# EAGLE design openWall_onBoardPCB (EAGLE 6.4)
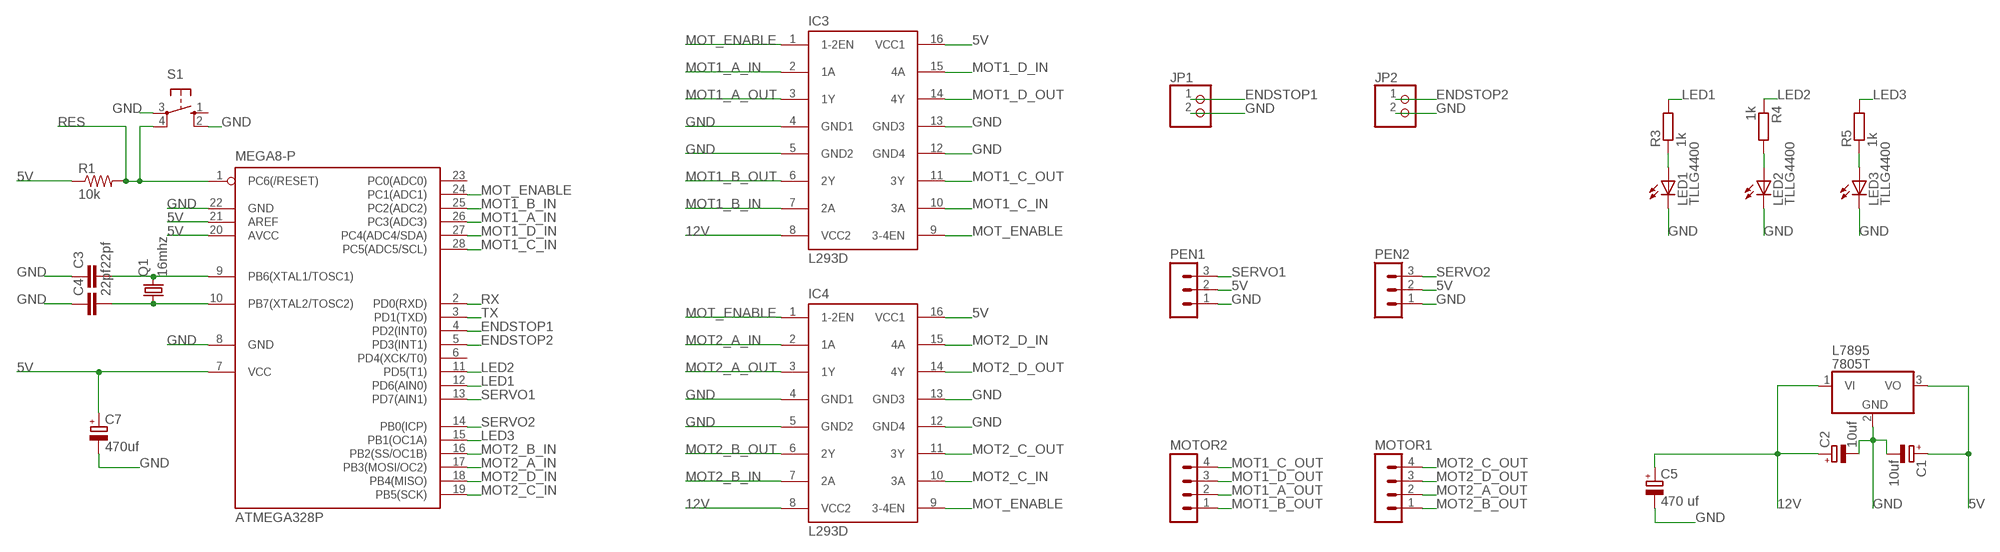
[diagram p0: schematic, sheet 1, part 1 of 2]
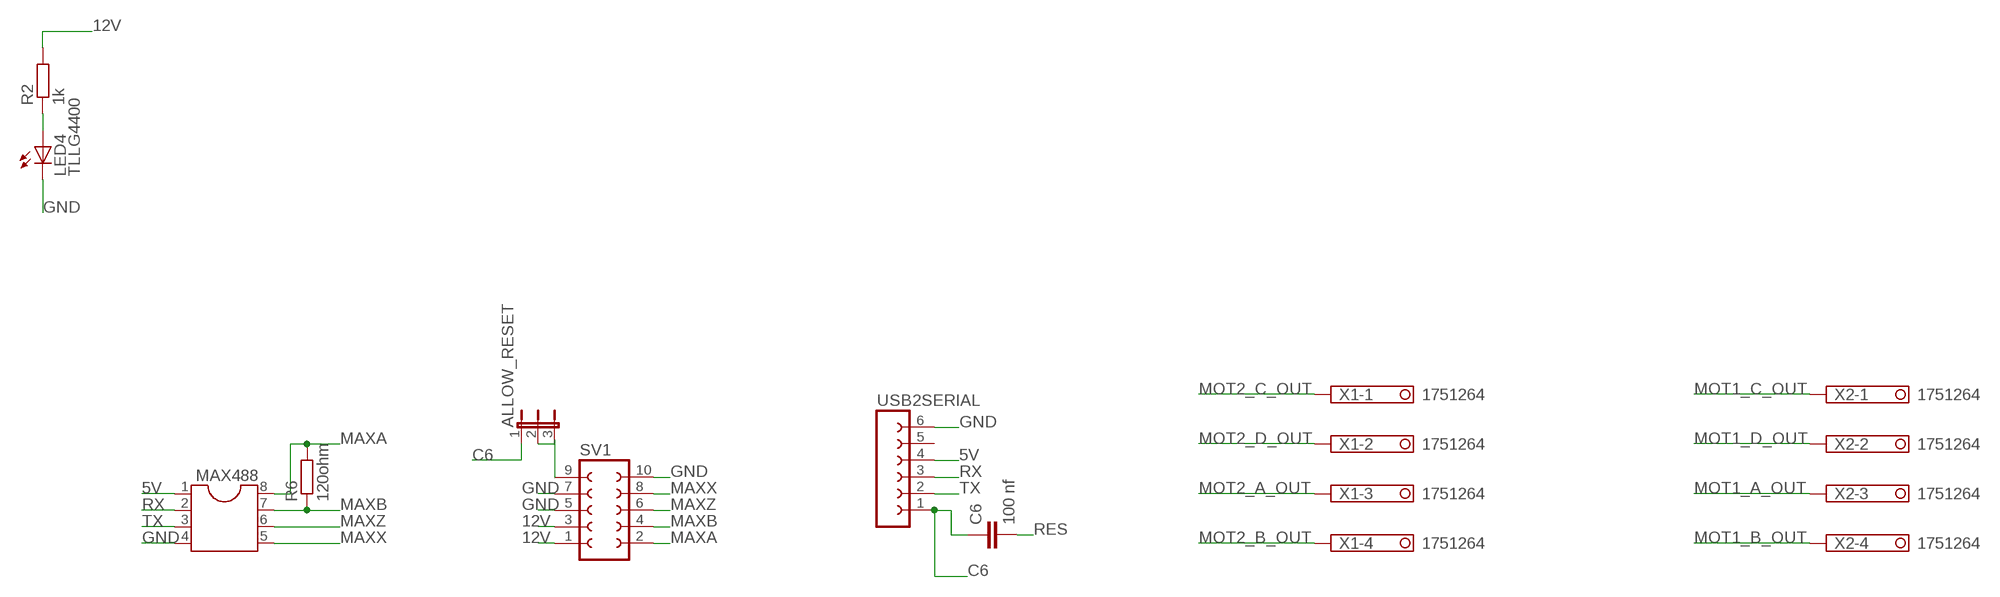
[diagram p1: schematic, sheet 1, part 2 of 2]

## Parts
ALLOW_RESET  JP2E  [JP2]
ATMEGA328P  MEGA8-P  [DIL28-3]
C1  10uf  CPOL-EUE2.5-6  [E2,5-6]
C2  10uf  CPOL-EUE2.5-6  [E2,5-6]
C3  22pf  C-EU025-030X050  [C025-030X050]
C4  22pf  C-EU025-030X050  [C025-030X050]
C5  470 uf  CPOL-EUE5-6  [E5-6]
C6  100 nf  C-EU050-024X044  [C050-024X044]
C7  470uf  CPOL-EUE5-6  [E5-6]
IC3  L293D  [DIL16]
IC4  L293D  [DIL16]
JP1  PINHD-1X2  [1X02]
JP2  PINHD-1X2  [1X02]
L7895  7805T  [TO220H]
LED1  TLLG4400  [LED3MM]
LED2  TLLG4400  [LED3MM]
LED3  TLLG4400  [LED3MM]
LED4  TLLG4400  [LED3MM]
MAX488  DIL8  [DIL08]
MOTOR1  MA04-1  [MA04-1]
MOTOR2  MA04-1  [MA04-1]
PEN1  MA03-1  [MA03-1]
PEN2  MA03-1  [MA03-1]
Q1  16mhz  CRYSTALHC49S  [HC49/S]
R1  10k  R-US_0207/7  [0207/7]
R2  1k  R-EU_0207/7  [0207/7]
R3  1k  R-EU_0309/V  [0309V]
R4  1k  R-EU_0309/V  [0309V]
R5  1k  R-EU_0309/V  [0309V]
R6  120ohm  R-EU_0207/7  [0207/7]
S1  10-XX  [B3F-10XX]
SV1  FE05-2  [FE05-2]
USB2SERIAL  FE06-1  [FE06]
X1  1751264  [1751264]
X2  1751264  [1751264]

## Nets
5V: ATMEGA328P.7(VCC) ATMEGA328P.20(AVCC) ATMEGA328P.21(AREF) C1.+ C7.+ IC3.16(VCC1) IC4.16(VCC1) L7895.3(VO) MAX488.1 PEN1.2 PEN2.2 R1.1 USB2SERIAL.4
12V: C2.+ C5.+ IC3.8(VCC2) IC4.8(VCC2) L7895.1(VI) R2.2 SV1.1 SV1.3
C6: ALLOW_RESET.1 C6.1 USB2SERIAL.1
ENDSTOP1: ATMEGA328P.4(PD2(INT0)) JP1.1
ENDSTOP2: ATMEGA328P.5(PD3(INT1)) JP2.1
GND: ATMEGA328P.8(GND) ATMEGA328P.22(GND) C1.- C2.- C3.1 C4.1 C5.- C7.- IC3.4(GND1) IC3.5(GND2) IC3.12(GND4) IC3.13(GND3) IC4.4(GND1) IC4.5(GND2) IC4.12(GND4) IC4.13(GND3) JP1.2 JP2.2 L7895.2(GND) LED1.K(C) LED2.K(C) LED3.K(C) LED4.K(C) MAX488.4 PEN1.1 PEN2.1 S1.2(S1) S1.3(P) SV1.5 SV1.7 SV1.10 USB2SERIAL.6
LED1: ATMEGA328P.12(PD6(AIN0)) R3.2
LED2: ATMEGA328P.11(PD5(T1)) R4.1
LED3: ATMEGA328P.15(PB1(OC1A)) R5.2
MAXA: MAX488.8 R6.2 SV1.2
MAXB: MAX488.7 R6.1 SV1.4
MAXX: MAX488.5 SV1.8
MAXZ: MAX488.6 SV1.6
MOT1_A_IN: ATMEGA328P.26(PC3(ADC3)) IC3.2(1A)
MOT1_A_OUT: IC3.3(1Y) MOTOR2.2 X2.3
MOT1_B_IN: ATMEGA328P.25(PC2(ADC2)) IC3.7(2A)
MOT1_B_OUT: IC3.6(2Y) MOTOR2.1 X2.4
MOT1_C_IN: ATMEGA328P.28(PC5(ADC5/SCL)) IC3.10(3A)
MOT1_C_OUT: IC3.11(3Y) MOTOR2.4 X2.1
MOT1_D_IN: ATMEGA328P.27(PC4(ADC4/SDA)) IC3.15(4A)
MOT1_D_OUT: IC3.14(4Y) MOTOR2.3 X2.2
MOT2_A_IN: ATMEGA328P.17(PB3(MOSI/OC2)) IC4.2(1A)
MOT2_A_OUT: IC4.3(1Y) MOTOR1.2 X1.3
MOT2_B_IN: ATMEGA328P.16(PB2(SS/OC1B)) IC4.7(2A)
MOT2_B_OUT: IC4.6(2Y) MOTOR1.1 X1.4
MOT2_C_IN: ATMEGA328P.19(PB5(SCK)) IC4.10(3A)
MOT2_C_OUT: IC4.11(3Y) MOTOR1.4 X1.1
MOT2_D_IN: ATMEGA328P.18(PB4(MISO)) IC4.15(4A)
MOT2_D_OUT: IC4.14(4Y) MOTOR1.3 X1.2
MOT_ENABLE: ATMEGA328P.24(PC1(ADC1)) IC3.1(1-2EN) IC3.9(3-4EN) IC4.1(1-2EN) IC4.9(3-4EN)
N$1: ATMEGA328P.10(PB7(XTAL2/TOSC2)) C4.2 Q1.1
N$2: ATMEGA328P.9(PB6(XTAL1/TOSC1)) C3.2 Q1.2
N$3: LED1.A R3.1
N$4: LED4.A R2.1
N$5: LED2.A R4.2
N$6: LED3.A R5.1
N$7: SV1.9
N$10: ALLOW_RESET.2 ALLOW_RESET.3
RES: ATMEGA328P.1(PC6(/RESET)) C6.2 R1.2 S1.4(P1)
RX: ATMEGA328P.2(PD0(RXD)) MAX488.2 USB2SERIAL.3
SERVO1: ATMEGA328P.13(PD7(AIN1)) PEN1.3
SERVO2: ATMEGA328P.14(PB0(ICP)) PEN2.3
TX: ATMEGA328P.3(PD1(TXD)) MAX488.3 USB2SERIAL.2
Unconnected: ATMEGA328P.6(PD4(XCK/T0)) ATMEGA328P.23(PC0(ADC0)) S1.1(S) USB2SERIAL.5

## Library data of the parts
ALLOW_RESET = jumper:JP2E: JUMPER
ATMEGA328P = atmel:MEGA8-P: MICROCONTROLLER 8 Kbytes FLASH, 1 kbytes SRAM, 512 bytes EEPROM, USART, 4-channel 10 bit ADC, 2-channel 8 bit ADC Pin compatible with Atmega48, ATMega88, ATMega168 Source: avr.lbr; OC_FARNELL: unknown; OC_NEWARK: unknown
C1 C2 C5 C7 = rcl:CPOL-EU: POLARIZED CAPACITOR, European symbol
C3 C4 C6 = rcl:C-EU: CAPACITOR, European symbol
IC3 IC4 = st-microelectronics:L293D: PUSH-PULL 4 CHANNEL DRIVER; MPN: L293D; OC_FARNELL: 9589619; OC_NEWARK: 56P8249
JP1 JP2 = pinhead:PINHD-1X2: PIN HEADER
L7895 = adafruit:78*: Positive VOLTAGE REGULATOR Added bigger pads to the TO-92 package
LED1-LED4 = led:TLLG4400: Low Current (2mA) LED 3 mm Tinted Diffused Package color GREEN Source: Data sheet <http://www.farnell.com/datasheets/391098.pdf>; MF: VISHAY SEMICONDUCTOR; OC_FARNELL: 1612435
MAX488 = ic-package:DIL8: Dual In Line / Socket
MOTOR1 MOTOR2 = con-lstb:MA04-1: PIN HEADER; OC_FARNELL: unknown; OC_NEWARK: unknown
PEN1 PEN2 = con-lstb:MA03-1: PIN HEADER; OC_FARNELL: unknown; OC_NEWARK: unknown
Q1 = adafruit:CRYSTAL: CRYSTAL; OC_FARNELL: 1667008; OC_NEWARK: unknown
R1 = adafruit:R-US_: RESISTOR, American symbol
R2 = resistor:R-EU_: RESISTOR, European symbol
R3-R6 = rcl:R-EU_: RESISTOR, European symbol
S1 = switch-omron:10-XX: OMRON SWITCH; MPN: B3F-1000; OC_FARNELL: 176432; OC_NEWARK: 36M3542
SV1 = con-lsta:FE05-2: FEMALE HEADER; OC_FARNELL: unknown; OC_NEWARK: unknown
USB2SERIAL = con-lsta:FE06-1: FEMALE HEADER; OC_FARNELL: unknown; OC_NEWARK: unknown
X1 X2 = con-phoenix-350:1751264: MKDS 1/ 4-3,5 Printklemme Nennstrom: 10 A Bemessungsspannung: 160 V Raster: 3,5 mm Polzahl: 4 Montageart: Löten Anschlussart: Schraubanschluss Anschlussrichtung vom Leiter zur Platine: 0° Source: http://eshop.phoenixcontact.com .. 1751264.pdf; MPN: 1751264; OC_FARNELL: unknown; OC_NEWARK: 10R0934

## Board
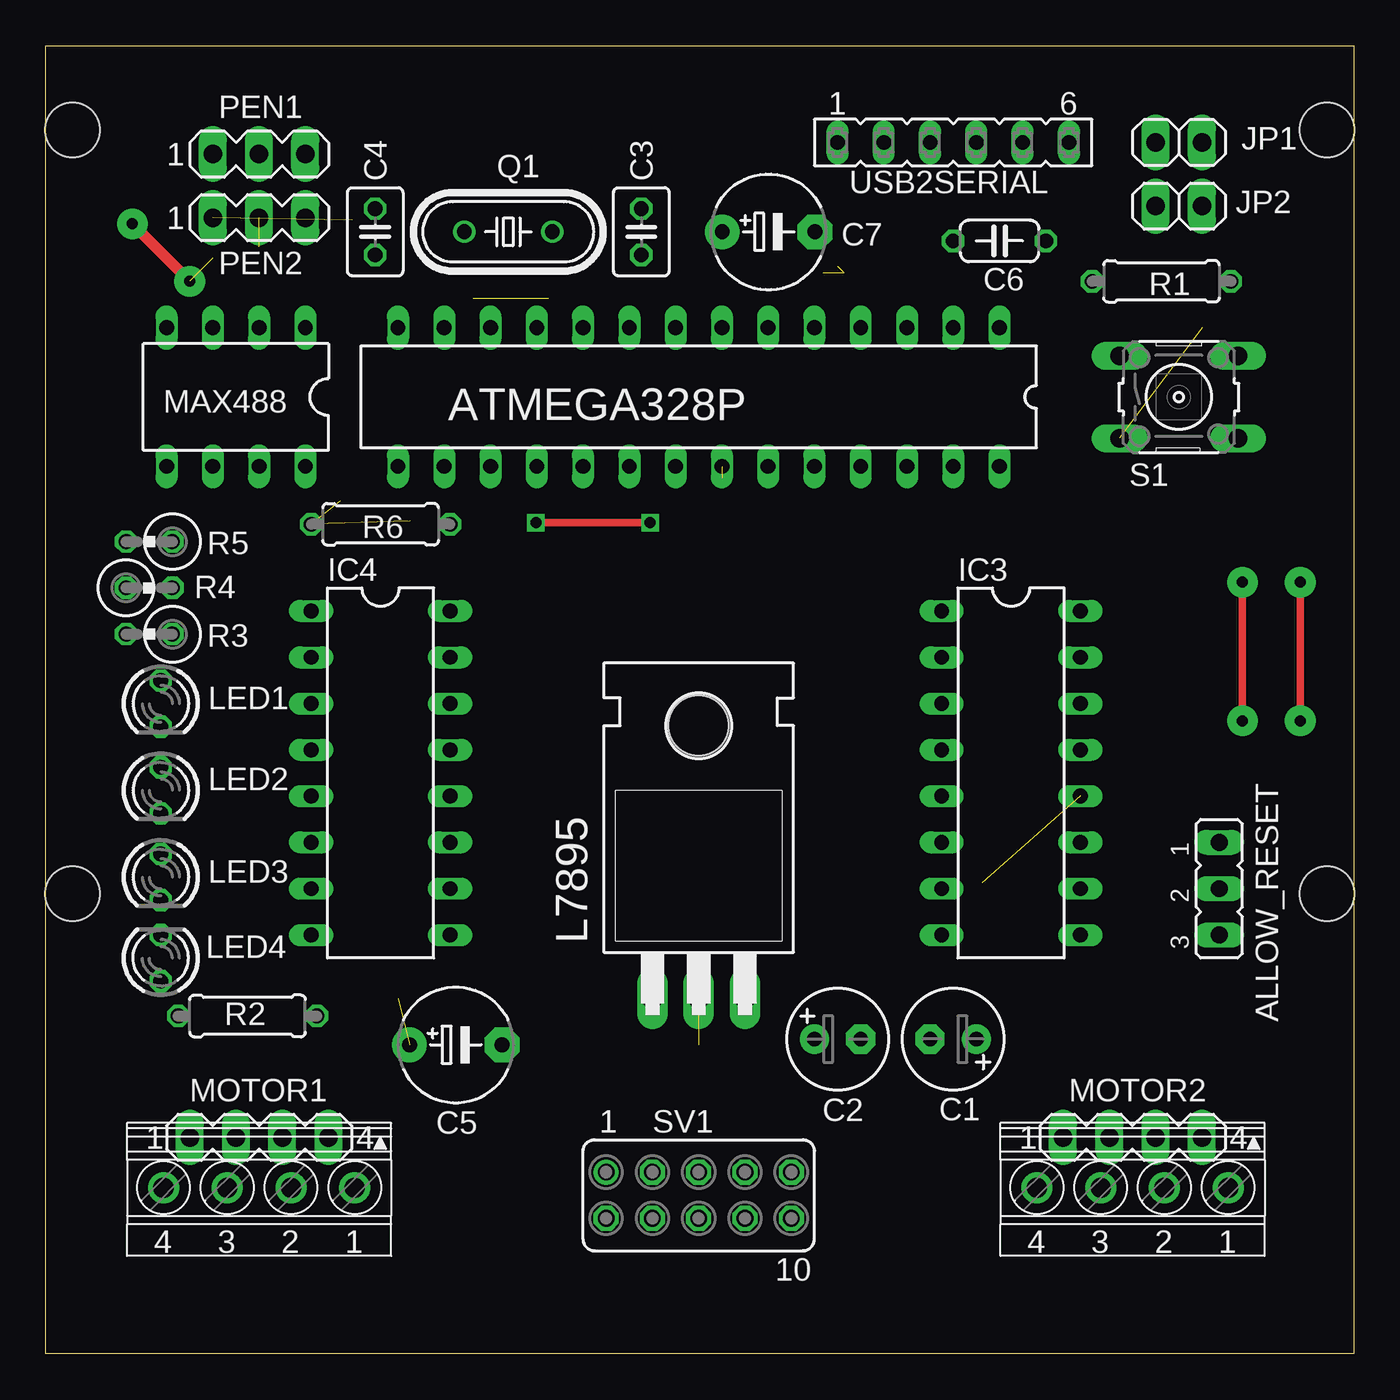
[diagram p2: board, top side]
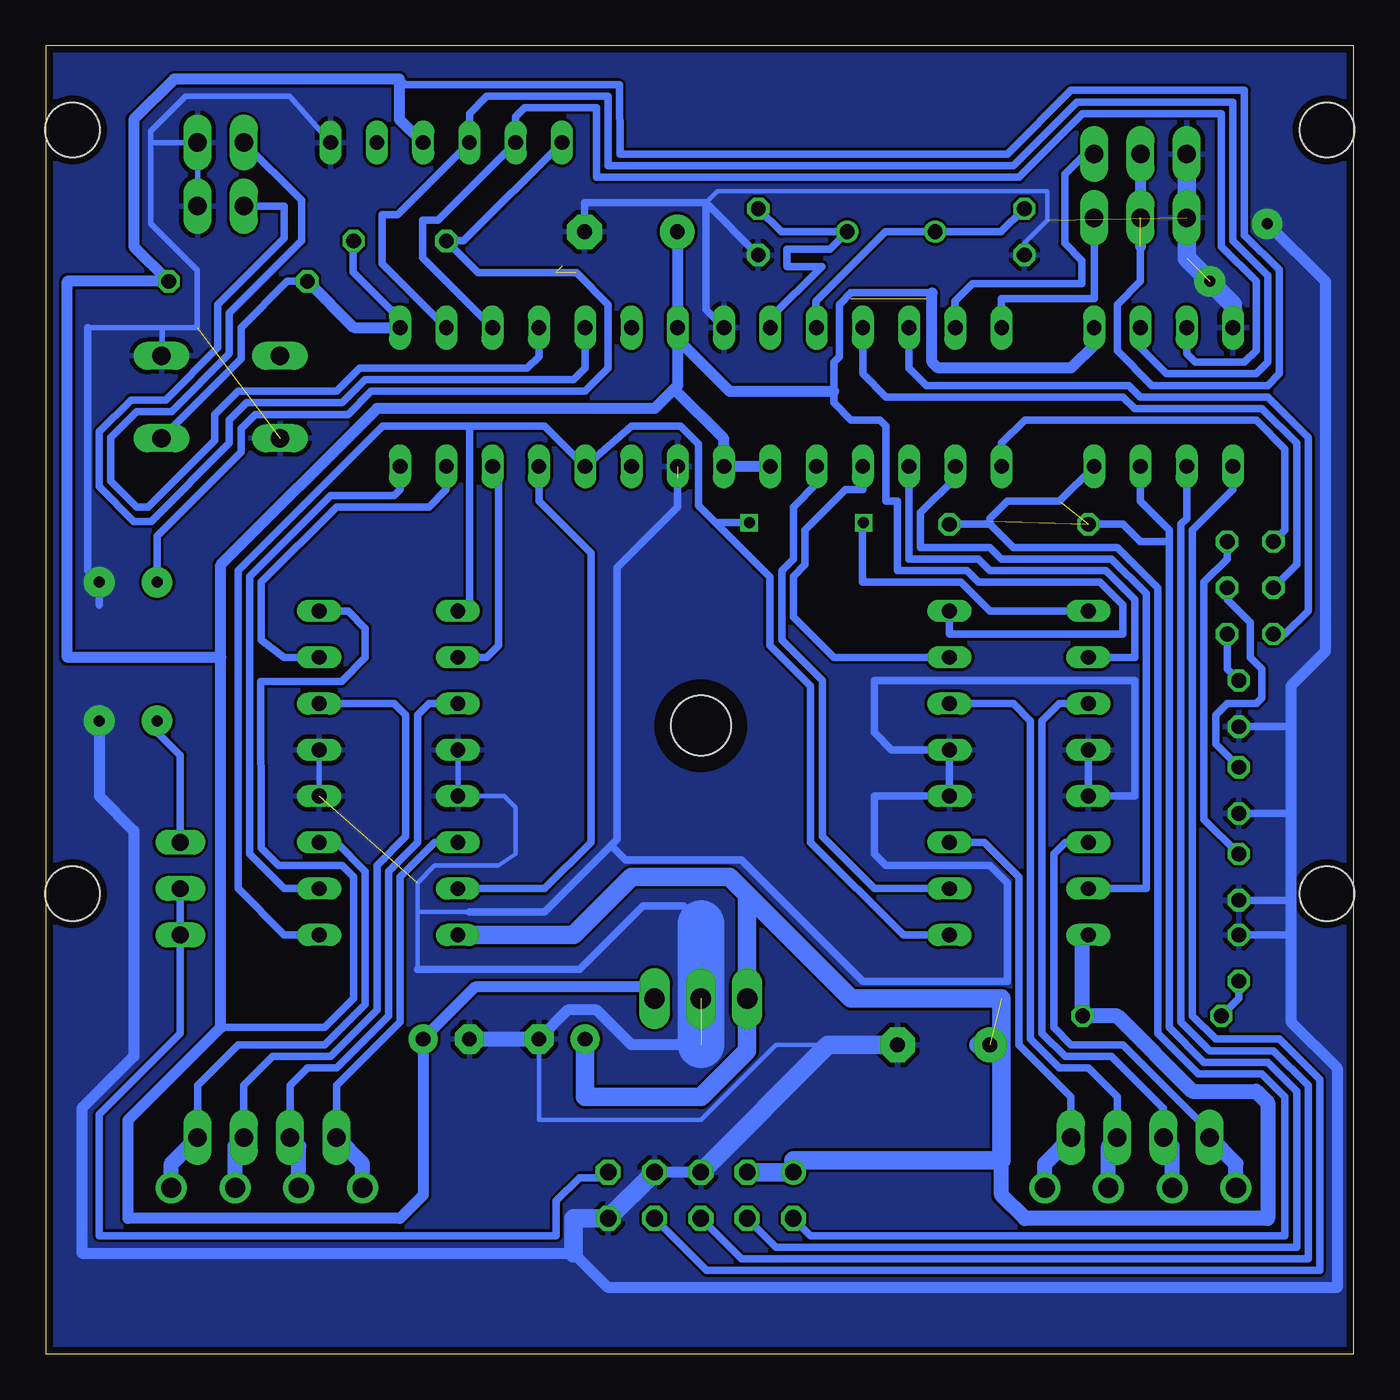
[diagram p3: board, bottom side, seen from below]

Size 71.82 x 71.82 mm. Coordinates in mm from the lower left corner, seen from the top.
Outline: 0,71.82 71.82,71.82 71.82,0 0,0 0,71.82
Copper layers (1*16): Top 0.0356mm / dielectric 1.5011mm / Bottom 0.0356mm
Design rules "LaenPCBOrder": minimum track width 6mil, minimum drill 13mil, track to track 6mil, track to pad 6mil, pad to pad 6mil, via to via 6mil, smd to smd 6mil, copper to edge 15mil, drill to drill 6mil, minimum pad ring 7mil, minimum via ring 7mil, stop-mask expansion 4mil, vias tented up to drill 0mil, thermal gap 10mil
Holes 3 mm at 1.49,67.2 1.49,25.26 70.33,67.2 70.33,25.26

### Footprints (pad centres in the part's own frame; a part is rotated, then mirrored left to right if it is on the bottom)
JP2 = drill 0.914 long: 1 -2.54,0; 2 0,0; 3 2.54,0
DIL28-3 = drill 0.813 long: 1 -16.51,-3.81; 2 -13.97,-3.81; 3 -11.43,-3.81; 4 -8.89,-3.81; 5 -6.35,-3.81; 6 -3.81,-3.81; 7 -1.27,-3.81; 8 1.27,-3.81; 9 3.81,-3.81; 10 6.35,-3.81; 11 8.89,-3.81; 12 11.43,-3.81; 13 13.97,-3.81; 14 16.51,-3.81; 15 16.51,3.81; 16 13.97,3.81; 17 11.43,3.81; 18 8.89,3.81; 19 6.35,3.81; 20 3.81,3.81; 21 1.27,3.81; 22 -1.27,3.81; 23 -3.81,3.81; 24 -6.35,3.81; 25 -8.89,3.81; 26 -11.43,3.81; 27 -13.97,3.81; 28 -16.51,3.81
E2,5-6 = drill 0.813 pad 1.6: + -1.27,0 | drill 0.813 pad 1.6 octagon: - 1.27,0
C025-030X050 = drill 0.813 octagon: 1 -1.27,0; 2 1.27,0
E5-6 = drill 0.813 pad 1.905: + -2.54,0 | drill 0.813 pad 1.905 octagon: - 2.54,0
C050-024X044 = drill 0.813 octagon: 1 -2.54,0; 2 2.54,0
DIL16 = drill 0.813 long: 1 -8.89,-3.81; 2 -6.35,-3.81; 3 -3.81,-3.81; 4 -1.27,-3.81; 5 1.27,-3.81; 6 3.81,-3.81; 7 6.35,-3.81; 8 8.89,-3.81; 9 8.89,3.81; 10 6.35,3.81; 11 3.81,3.81; 12 1.27,3.81; 13 -1.27,3.81; 14 -3.81,3.81; 15 -6.35,3.81; 16 -8.89,3.81
1X02 = drill 1.016 long: 1 -1.27,0; 2 1.27,0
TO220H = drill 1.118 long: 1 -2.54,-10.16; 2 0,-10.16; 3 2.54,-10.16 | hole 3.302: 0,4.826
LED3MM = drill 0.813 octagon: A -1.27,0; K 1.27,0
DIL08 = drill 0.813 long: 1 -3.81,-3.81; 2 -1.27,-3.81; 3 1.27,-3.81; 4 3.81,-3.81; 5 3.81,3.81; 6 1.27,3.81; 7 -1.27,3.81; 8 -3.81,3.81
MA04-1 = drill 1.016 long: 1 -3.81,0; 2 -1.27,0; 3 1.27,0; 4 3.81,0
MA03-1 = drill 1.016 long: 1 -2.54,0; 2 0,0; 3 2.54,0
HC49/S = drill 0.813: 1 -2.413,0; 2 2.413,0
0207/7 = drill 0.813 octagon: 1 -3.81,0; 2 3.81,0
0309V = drill 0.813 octagon: 1 -1.27,0; 2 1.27,0
B3F-10XX = drill 1.016 long: 1 -3.251,2.261; 2 3.251,2.261; 3 -3.251,-2.261; 4 3.251,-2.261
FE05-2 = drill 0.914: 1 -5.08,1.27 | drill 0.914 octagon: 2 -5.08,-1.27; 3 -2.54,1.27; 4 -2.54,-1.27; 5 0,1.27; 6 0,-1.27; 7 2.54,1.27; 8 2.54,-1.27; 9 5.08,1.27; 10 5.08,-1.27
FE06 = drill 0.813 long: 1 -6.35,0; 2 -3.81,0; 3 -1.27,0; 4 1.27,0; 5 3.81,0; 6 6.35,0
1751264 = drill 1.1 pad 1.7: 1 -5.25,-0.1; 2 -1.75,-0.1; 3 1.75,-0.1; 4 5.25,-0.1

### Placement (x,y rotation side)
ALLOW_RESET  64.43,25.54 270 top
ATMEGA328P  35.85,52.53 180 top
C1  49.82,17.28 180 top
C2  43.47,17.28 0 top
C3  32.7,61.59 90 top
C4  18.1,61.59 90 top
C5  22.52,16.97 0 top
C6  52.36,61.1 0 top
C7  39.69,61.59 0 top
IC3  53,31.89 270 top
IC4  18.39,31.89 270 top
JP1  62.2,66.5 0 top
JP2  62.2,63 0 top
L7895  35.85,29.67 0 top
LED1  6.32,35.7 270 top
LED2  6.32,30.94 270 top
LED3  6.32,26.17 270 top
LED4  6.32,21.73 90 top
MAX488  10.45,52.53 180 top
MOTOR1  11.72,11.89 0 top
MOTOR2  59.66,11.89 0 top
PEN1  11.72,65.86 0 top
PEN2  11.72,62.37 0 top
Q1  25.4,61.59 0 top
R1  61.25,58.88 180 top
R2  11.09,18.55 0 top
R3  5.69,39.51 180 top
R4  5.69,42.05 0 top
R5  5.69,44.59 180 top
R6  18.39,45.54 180 top
S1  62.2,52.53 0 top
SV1  35.85,8.71 0 top
USB2SERIAL  49.82,66.5 0 top
X1  11.72,9.03 180 top
X2  59.66,9.03 180 top

### Tracks (layer width: path | path; a pad name or v marks a point on that pad's centre or on a via)
5V  (2 unrouted)
  Bottom 0.406: IC3.16 55.22,40.78 54.27,39.83 54.27,38.24 55.55,36.92 60,36.92 59.98,27.76 59.03,26.81 55.54,26.81 54.9,26.18 54.9,19.51 56.49,17.92 62.2,17.92 | IC4.16 22.2,39.51 12.68,39.51 12.68,41.1 13.95,42.37 20.61,42.37 21.25,43 25.06,43 25.06,46.81 25.69,46.81 25.69,50.94 26.01,51.26 27.6,51.26 28.55,52.21 28.55,52.84 28.55,54.43 28.23,54.75 28.23,57.61 27.6,58.24 23.15,58.24 | 11.72,60.78 11.72,58.88 12.99,57.61 12.99,55.07 11.09,53.16 4.74,53.16 4.1,53.8 4.1,59.51 6.01,61.42 6.01,69.36 15.53,69.36 19.02,65.86 40.3,65.86 40.32,69.66 52.07,69.66 52.39,69.98
  Bottom 0.61: 62.2,38.24 62.2,17.92 67.28,12.84 67.28,7.44 52.36,7.44 51.09,8.71 C1.+ 48.23,20.14 39.03,20.14 L7895.3 | 62.2,38.24 70.62,38.24 70.62,58.88 R1.1 66.97,60.78 66.97,67.77 64.77,69.98 52.39,69.98 52.39,67.75 USB2SERIAL.4 | PEN1.2 11.72,60.78 | 23.15,58.24 23.15,54.43 22.84,54.12 15.53,54.12 14.26,55.38 MAX488.1 | ATMEGA328P.7 37.12,53.16 37.31,52.97 | 37.31,52.97 38.39,51.89 53.63,51.89 62.2,43.32 62.2,38.24 | ATMEGA328P.7 37.12,55.7 34.27,52.84 28.55,52.84 | ATMEGA328P.20 ATMEGA328P.21 34.58,50.24 37.31,52.97 | C7.+ 37.12,60.66 ATMEGA328P.7
12V  (1 unrouted)
  Bottom 0.813: IC4.8 14.9,23 R2.2 12.99,18.55 8.87,14.43 5.37,14.43 4.74,13.79 4.74,7.44 18.07,7.44 19.34,8.71 19.34,10.62 | 30.77,10.62 SV1.1
  Bottom 1.016: IC3.8 42.84,23 39.66,26.18 34.27,26.18 33.31,25.22 | 33.31,25.22 27.6,19.51 19.34,19.51 19.34,10.62 30.77,10.62 | 33.31,25.22 L7895.1 33.31,16.65 35.85,14.11 42.2,14.11 C2.+ | SV1.3 SV1.1 | C5.+ 20.61,16.97
C6  (via drill 0.6 pad 1.68)  (2 unrouted)
  Top 0.406: v65.7,34.75 v65.7,42.37
  Bottom 0.406: v65.7,42.37 65.7,44.91 61.09,49.51 61.09,50.78 60.3,51.58 55.22,51.58 53.95,52.84 42.2,52.84 40.93,54.12 40.93,57.61 42.68,59.35 48.08,59.35 C6.1 48.87,61.1 USB2SERIAL.1 | ALLOW_RESET.1 64.43,32.84 65.7,34.11 v65.7,34.75
ENDSTOP1
  Bottom 0.406: ATMEGA328P.4 44.74,54.75 45.38,54.12 54.59,54.12 55.85,52.84 61.25,52.84 62.52,51.58 62.52,50.15 66.17,46.49 66.81,46.49 68.24,47.92 68.24,50.3 66.81,51.73 64.9,51.73 61.73,54.91 61.73,57.13 57.76,61.1 57.76,63.32 JP1.1
ENDSTOP2
  Bottom 0.406: JP2.1 59.37,62.99 58.71,63.01 58.71,61.26 62.36,57.61 62.36,55.23 65.22,52.37 67.13,52.37 68.87,50.62 68.87,47.61 66.97,45.7 66.02,45.7 61.73,49.99 61.73,51.26 60.78,52.21 55.54,52.21 54.27,53.48 42.84,53.48 42.2,54.12 ATMEGA328P.5
GND  (via drill 0.6 pad 1.68)  (6 unrouted)
  Top 0.406: v68.87,42.37 v68.87,34.75
  Top 0.61: v4.76,62.04 v7.91,58.88
  Bottom 0.254: 48.55,24.27 51.41,24.27 | 51.41,24.27 51.41,25.86 50.46,26.81 46.97,26.81 46.01,27.45 46.01,29.98 46.65,30.62 IC3.5 | 51.41,21.09 51.41,24.27 | 28.87,16.97 31.73,16.97 35.85,12.84 44.74,12.84 C2.- | C4.1 18.1,60.96 16.83,62.23 16.83,63.82 34.92,63.82 35.56,63.18
  Bottom 0.305: IC3.4 IC3.5 | IC3.12 IC3.13 | USB2SERIAL.6 58.42,69.03 64.14,69.03 66.04,67.12 66.04,66.48 | 66.04,66.48 66.04,62.04 63.5,59.5 63.5,56.33 65.4,56.33 | 65.4,56.33 69.51,56.34 | 42.84,7.44 42.84,7.28 | JP2.2 JP1.2 66.04,66.48 | S1.2 65.4,56.33
  Bottom 0.406: 48.55,24.27 44.42,24.27 40.77,27.92 | IC4.4 IC4.5 12.04,30.62 12.04,36.97 26.33,36.97 26.33,34.11 25.38,33.16 IC4.13 IC4.12 26.33,30.62 26.33,27.45 25.69,26.81 19.98,26.81 19.02,25.86 19.02,20.46 26.96,20.46 33.63,27.13 39.98,27.13 40.77,27.92 | 40.77,27.92 40.46,28.24 40.46,43.16 37.12,46.49 37.12,48.08 | 51.41,21.09 42.52,21.09 39.03,24.59 36.8,24.59 35.85,23.64 | 69.51,56.34 69.51,43 v68.87,42.37 68.87,41.1 | LED3.K 3.47,24.91 | LED2.K 3.47,29.67 | LED1.K 3.47,34.43 | LED4.K 3.47,23 | ATMEGA328P.8 35.56,57.31 35.56,63.18 | 35.56,63.18 42.23,63.18 C7.- | C3.1 35.56,63.18
  Bottom 0.61: v68.87,34.75 68.87,30.62 66.97,28.71 66.97,16.33 69.83,13.47 69.83,5.54 42.84,5.54 40.93,3.63 0.93,3.63 0.93,15.7 3.47,18.24 3.47,23 3.47,24.91 3.47,29.67 3.47,34.43 3.47,36.65 1.56,38.56 1.56,58.88 v4.76,62.04 | SV1.5 SV1.7 | 35.85,16.97 39.66,16.97 41.57,18.87 43.16,18.87 C2.-
  Bottom 0.813: C1.- C2.-
  Bottom 1.016: 42.84,5.54 42.84,7.28 | SV1.7 SV1.10 42.84,7.44 | C5.- 28.87,16.97 SV1.5 | MAX488.4 6.64,57.61 9.18,60.15 PEN2.1 PEN1.1
  Bottom 2.54: 35.85,23.64 35.85,16.97
  pour Bottom: 0,71.75 71.75,71.75 71.75,0 0,0
LED1
  Bottom 0.406: ATMEGA328P.12 24.42,54.12 23.47,53.16 12.36,53.16 11.72,52.53 4.74,52.53 2.52,50.3 2.52,40.78 3.79,39.51 R3.2
LED2
  Bottom 0.406: ATMEGA328P.11 26.96,53.8 25.69,52.53 12.68,52.53 12.04,51.89 5.05,51.89 3.15,49.99 3.15,43.32 R4.1
LED3
  Bottom 0.406: R5.2 3.79,45.23 3.79,49.67 5.37,51.26 18.07,51.26 19.34,49.99 ATMEGA328P.15
MAXA  (1 unrouted)
  Bottom 0.406: MAX488.8 16.17,46.81 19.02,46.81 19.98,45.86 19.98,45.54 18.71,44.27 12.99,44.27 10.77,42.05 10.77,17.6 8.55,15.38 5.05,15.38 3.79,14.11 3.79,6.49 29.82,6.49 SV1.2
MAXB  (1 unrouted)
  Bottom 0.406: SV1.4 31.73,5.86 3.15,5.86 3.15,14.43 4.74,16.02 8.23,16.02 10.13,17.92 10.13,44.59 | MAX488.7 11.72,46.81 10.13,45.23 10.13,44.59 | 10.13,44.59 11.72,44.59 12.68,45.54 14.61,45.54 14.61,45.4 | R6.1 20,45.54 20,45.72
MAXX
  Bottom 0.406: SV1.8 35.53,4.58 1.88,4.58 1.88,15.06 4.1,17.29 7.59,17.29 8.87,18.55 8.87,45.23 6.64,47.45 MAX488.5
MAXZ
  Bottom 0.406: SV1.6 33.63,5.22 2.52,5.22 2.52,14.74 4.42,16.65 7.91,16.65 9.5,18.24 9.5,45.54 9.18,45.86 MAX488.6
MOT1_A_IN
  Bottom 0.406: IC3.2 47.6,38.24 46.97,38.88 46.97,48.4 ATMEGA328P.26
MOT1_A_OUT
  Bottom 0.406: IC3.3 50.77,35.7 51.41,35.06 51.41,28.08 53,26.49 53,18.55 55.85,15.7 57.44,15.7 58.4,14.74 MOTOR2.2
  Bottom 0.813: X2.3 57.91,11.41 MOTOR2.2
MOT1_B_IN
  Bottom 0.406: IC3.7 44.42,25.54 41.88,28.08 41.88,43.95 44.74,46.81 ATMEGA328P.25
MOT1_B_OUT
  Bottom 0.406: IC3.6 50.46,28.08 52.36,26.18 52.36,18.24 55.85,14.74 MOTOR2.1
  Bottom 0.813: X2.4 54.41,10.45 MOTOR2.1
MOT1_C_IN
  Bottom 0.406: IC3.10 58.71,25.54 60.62,27.45 60.62,42.69 56.17,47.13 52.68,47.13 52.36,47.45 ATMEGA328P.28
MOT1_C_OUT
  Bottom 0.406: IC3.11 55.85,28.08 54.27,26.49 54.27,19.19 56.49,16.97 61.25,16.97 63.48,14.74 MOTOR2.4
  Bottom 0.813: X2.1 64.92,10.45 MOTOR2.4
MOT1_D_IN
  Bottom 0.406: ATMEGA328P.27 49.82,47.45 50.77,46.49 55.85,46.49 59.98,42.37 59.98,39.19 58.71,38.24 IC3.15
MOT1_D_OUT
  Bottom 0.406: IC3.14 52.68,35.7 52.05,35.06 52.05,28.4 53.63,26.81 53.63,18.87 56.17,16.33 59.35,16.33 60.94,14.74 MOTOR2.3
  Bottom 0.813: X2.2 61.41,11.41 MOTOR2.3
MOT2_A_IN
  Bottom 0.406: IC4.2 12.04,38.24 12.04,41.41 13.63,43 19.98,43 20.61,43.64 24.42,43.64 ATMEGA328P.17
MOT2_A_OUT
  Bottom 0.406: IC4.3 16.17,35.7 17.12,34.75 17.12,17.6 15.85,16.33 13.31,16.33 10.45,13.47 MOTOR1.2
  Bottom 0.813: X1.3 9.97,11.41 MOTOR1.2
MOT2_B_IN
  Bottom 0.406: IC4.7 11.4,25.54 11.4,41.73 13.31,43.64 19.34,43.64 19.98,44.27 23.79,44.27 23.79,46.18 21.88,48.08 ATMEGA328P.16
MOT2_B_OUT
  Bottom 0.406: IC4.6 15.85,28.08 16.48,27.45 16.48,17.92 15.53,16.97 12.68,16.97 8.23,12.52 MOTOR1.1
  Bottom 0.813: X1.4 6.47,10.45 MOTOR1.1
MOT2_C_IN
  Bottom 0.406: IC4.10 26.33,25.54 29.18,28.4 29.18,36.97 31.41,39.19 31.41,43 30.77,43.64 30.77,46.49 29.5,47.77 ATMEGA328P.19
MOT2_C_OUT
  Bottom 0.406: IC4.11 20.3,28.08 18.39,26.18 18.39,16.97 15.53,14.11 MOTOR1.4
  Bottom 0.813: X1.1 16.97,10.45 MOTOR1.4
MOT2_D_IN
  Bottom 0.406: IC4.15 28.55,38.24 30.77,40.46 30.77,42.69 30.14,43.32 30.14,45.23 29.18,46.18 27.91,47.45 26.96,47.45 ATMEGA328P.18
MOT2_D_OUT
  Bottom 0.406: IC4.14 18.71,35.7 17.75,34.75 17.75,17.29 16.17,15.7 14.58,15.7 12.99,14.11 MOTOR1.3
  Bottom 0.813: X1.2 13.47,11.41 MOTOR1.3
MOT_ENABLE  (via drill 0.6)
  Top 0.406: v26.92,45.63 v33.19,45.63
  Bottom 0.406: 48.55,50.94 44.42,50.94 ATMEGA328P.24 39.66,50.94 36.97,50.94 35.98,49.95 35.98,46.56 35.05,45.63 | 48.55,50.94 48.55,40.78 IC3.1 | 48.55,50.94 53.31,50.94 61.25,43 61.25,25.54 58.71,23 IC3.9 | IC4.9 24.74,23 29.82,28.08 29.82,36.65 32.04,38.88 32.04,42.64 32.74,43.32 35.05,45.63 | IC4.1 19.98,40.78 21.57,42.37 26.98,42.37 26.98,45.21 v26.92,45.63 | v33.19,45.63 34.62,45.63 35.05,45.63
N$1
  Bottom 0.406: C4.2 19.37,61.59 Q1.1 25.72,61.59 29.53,57.78 29.53,56.36 ATMEGA328P.10
N$2
  Bottom 0.406: C3.2 31.43,61.59 Q1.2 28.77,60.64 31.11,60.64 31.11,59.69 29.21,59.69 32.04,56.86 ATMEGA328P.9
N$3
  Bottom 0.406: R3.1 6.96,37.6 LED1.A
N$4
  Bottom 0.406: LED4.A 6.33,19.51 R2.1
N$5
  Bottom 0.406: R4.2 6.96,41.41 5.69,40.15 5.69,38.24 5.05,37.6 5.05,36.02 5.37,35.7 6.96,35.7 7.59,35.06 7.59,33.48 LED2.A
N$6
  Bottom 0.406: R5.1 6.96,43.64 8.23,42.37 8.23,29.35 LED3.A
N$10
  Bottom 0.406: 40.93,9.66 42.52,9.66 43.79,8.39 43.79,6.49 68.87,6.49 68.87,13.16 64.43,17.6 ALLOW_RESET.3 ALLOW_RESET.2
RES
  Bottom 0.406: R1.2 58.55,58.88 61.09,56.34 61.09,54.63 S1.4 | ATMEGA328P.1 52.36,57.29 52.84,57.29 54.93,59.37 54.93,61.07 C6.2
  Bottom 0.61: R1.2 54.9,56.34 ATMEGA328P.1
RX
  Bottom 0.406: MAX488.2 11.72,55.23 10.29,53.8 5.37,53.8 4.74,54.43 4.74,59.2 6.64,61.1 6.64,68.72 15.21,68.72 18.71,65.23 40.93,65.23 40.93,69.04 47.6,69.04 48.55,68.08 USB2SERIAL.3 52.5,62.55 53.34,62.55 53.34,59.85 ATMEGA328P.2
SERVO1
  Bottom 0.406: PEN1.3 14.78,65.86 15.88,64.77 15.88,60.96 14.92,60.01 14.92,58.74 20.95,58.74 21.91,57.78 ATMEGA328P.13
SERVO2
  Bottom 0.406: PEN2.3 14.26,57.92 19.34,57.92 ATMEGA328P.14
TX
  Bottom 0.406: MAX488.3 9.18,54.91 8.71,54.43 6.01,54.43 5.37,55.07 5.37,58.88 7.28,60.78 7.28,68.08 14.9,68.08 18.39,64.59 41.57,64.59 41.57,68.4 45.54,68.4 46.01,67.93 USB2SERIAL.2 50.28,62.23 51.12,62.23 51.12,60.17 ATMEGA328P.3